# Altium schematic sheet sensor-board.SchDoc
size A; SheetNumber: 1; SheetTotal: 2
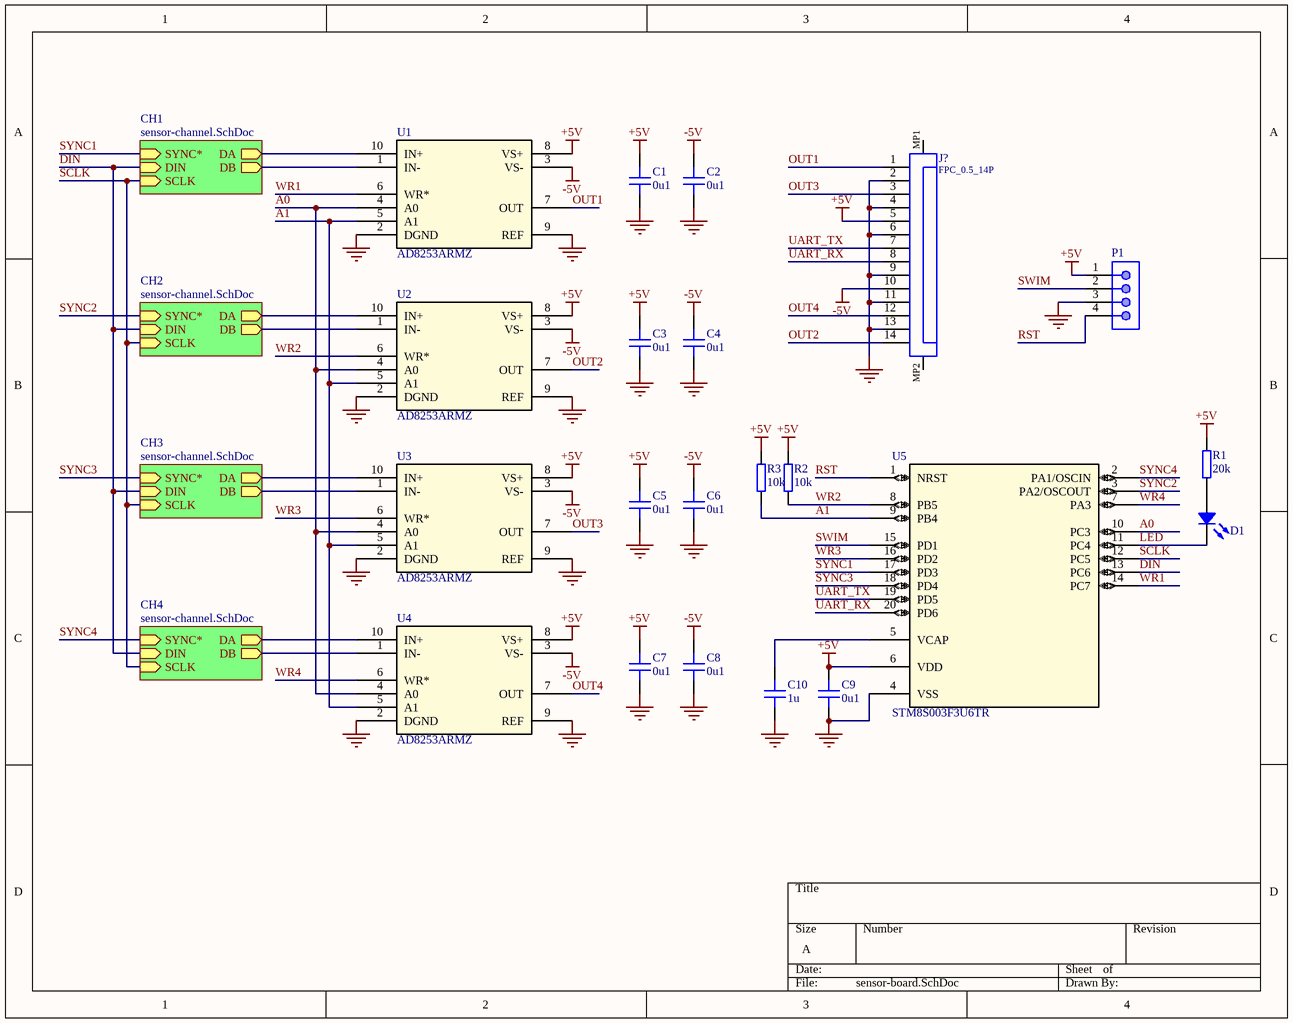
[diagram p0: sensor-board.SchDoc]

## Parts
C1  0u1  [CAP_0402]
C2  0u1  [CAP_0402]
C3  0u1  [CAP_0402]
C4  0u1  [CAP_0402]
C5  0u1  [CAP_0402]
C6  0u1  [CAP_0402]
C7  0u1  [CAP_0402]
C8  0u1  [CAP_0402]
C9  0u1  [CAP_0402]
C10  1u  [CAP_0402]
D1  LED_0402  [LED_0402]  (value not drawn)
J?  FPC_0.5_14P  [FPC_0.5_14P]
P1  PIN_1.27_4P  [PIN_1.27_4P]  (value not drawn)
R1  20k  [RES_0402]
R2  10k  [RES_0402]
R3  10k  [RES_0402]
U1  AD8253ARMZ  [RM_10_ADI]
U2  AD8253ARMZ  [RM_10_ADI]
U3  AD8253ARMZ  [RM_10_ADI]
U4  AD8253ARMZ  [RM_10_ADI]
U5  STM8S003F3U6TR  [UFQFPN20_3x3x0p6]

## Sub-sheets
CH1 = sensor-channel.SchDoc: SYNC* (in), DIN (in), SCLK (in), DA (out), DB (out)
CH2 = sensor-channel.SchDoc: SYNC* (in), DIN (in), SCLK (in), DA (out), DB (out)
CH3 = sensor-channel.SchDoc: SYNC* (in), DIN (in), SCLK (in), DA (out), DB (out)
CH4 = sensor-channel.SchDoc: SYNC* (in), DIN (in), SCLK (in), DA (out), DB (out)

## Nets
+5V: C1.1 C3.1 C5.1 C7.1 C9.1 J?.5 P1.1 R1.2 R2.2 R3.2 U1.8(VS+) U2.8(VS+) U3.8(VS+) U4.8(VS+) U5.6(VDD)
-5V: C2.1 C4.1 C6.1 C8.1 J?.10 U1.3(VS-) U2.3(VS-) U3.3(VS-) U4.3(VS-)
GND: C1.2 C2.2 C3.2 C4.2 C5.2 C6.2 C7.2 C8.2 C9.2 C10.2 J?.2 J?.4 J?.6 J?.9 J?.11 J?.13 P1.3 U1.2(DGND) U1.9(REF) U2.2(DGND) U2.9(REF) U3.2(DGND) U3.9(REF) U4.2(DGND) U4.9(REF) U5.4(VSS)
A0: U1.4(A0) U2.4(A0) U3.4(A0) U4.4(A0) U5.10(PC3)
A1: R3.1 U1.5(A1) U2.5(A1) U3.5(A1) U4.5(A1) U5.9(PB4)
DIN: U5.13(PC6) ; sheet CH1/DIN, sheet CH2/DIN, sheet CH3/DIN, sheet CH4/DIN
LED: D1.K U5.11(PC4)
OUT1: J?.1 U1.7(OUT)
OUT2: J?.14 U2.7(OUT)
OUT3: J?.3 U3.7(OUT)
OUT4: J?.12 U4.7(OUT)
RST: P1.4 U5.1(NRST)
SCLK: U5.12(PC5) ; sheet CH1/SCLK, sheet CH2/SCLK, sheet CH3/SCLK, sheet CH4/SCLK
SWIM: P1.2 U5.15(PD1)
SYNC1: U5.17(PD3) ; sheet CH1/SYNC*
SYNC2: U5.3(PA2/OSCOUT) ; sheet CH2/SYNC*
SYNC3: U5.18(PD4) ; sheet CH3/SYNC*
SYNC4: U5.2(PA1/OSCIN) ; sheet CH4/SYNC*
UART_RX: J?.8 U5.20(PD6)
UART_TX: J?.7 U5.19(PD5)
WR1: U1.6(WR*) U5.14(PC7)
WR2: R2.1 U2.6(WR*) U5.8(PB5)
WR3: U3.6(WR*) U5.16(PD2)
WR4: U4.6(WR*) U5.7(PA3)
NetC10_1: C10.1 U5.5(VCAP)
NetD1_A: D1.A R1.1
NetU1_1: U1.1(IN-) ; sheet CH1/DB
NetU1_10: U1.10(IN+) ; sheet CH1/DA
NetU2_1: U2.1(IN-) ; sheet CH2/DB
NetU2_10: U2.10(IN+) ; sheet CH2/DA
NetU3_1: U3.1(IN-) ; sheet CH3/DB
NetU3_10: U3.10(IN+) ; sheet CH3/DA
NetU4_1: U4.1(IN-) ; sheet CH4/DB
NetU4_10: U4.10(IN+) ; sheet CH4/DA

Not connected (* = marked no-connect by the designer): J? MP1 MP2

## Library data of the parts
C1-C10 = CAP_0402: Capacitor SMD 0402; Voltage: 50V
  C1-C9: Capacitance: 0u1
  C10: Capacitance: 1u
D1 = LED_0402: LED SMD 0402
J? = FPC_0.5_14P: FPC, Horizontal, pitch 0.5 mm, 14 pins
R1-R3 = RES_0402: Resistor SMD 0402
  R1: Resistance: 20k
  R2 R3: Resistance: 10k
U1-U4 = AD8253ARMZ: No Description Available; Mfr_Name: Analog Devices Inc; Copyright: Copyright (C) 2023 Ultra Librarian. All rights reserved.; Manufacturer_Part_Number: AD8253ARMZ; RefDes: RefDes; Type: DEV
U5 = STM8S003F3U6TR: No Description Available; Mfr_Name: STMicroelectronics; Copyright: Copyright (C) 2023 Ultra Librarian. All rights reserved.; Manufacturer_Part_Number: STM8S003F3U6TR; RefDes: RefDes; Type: Type